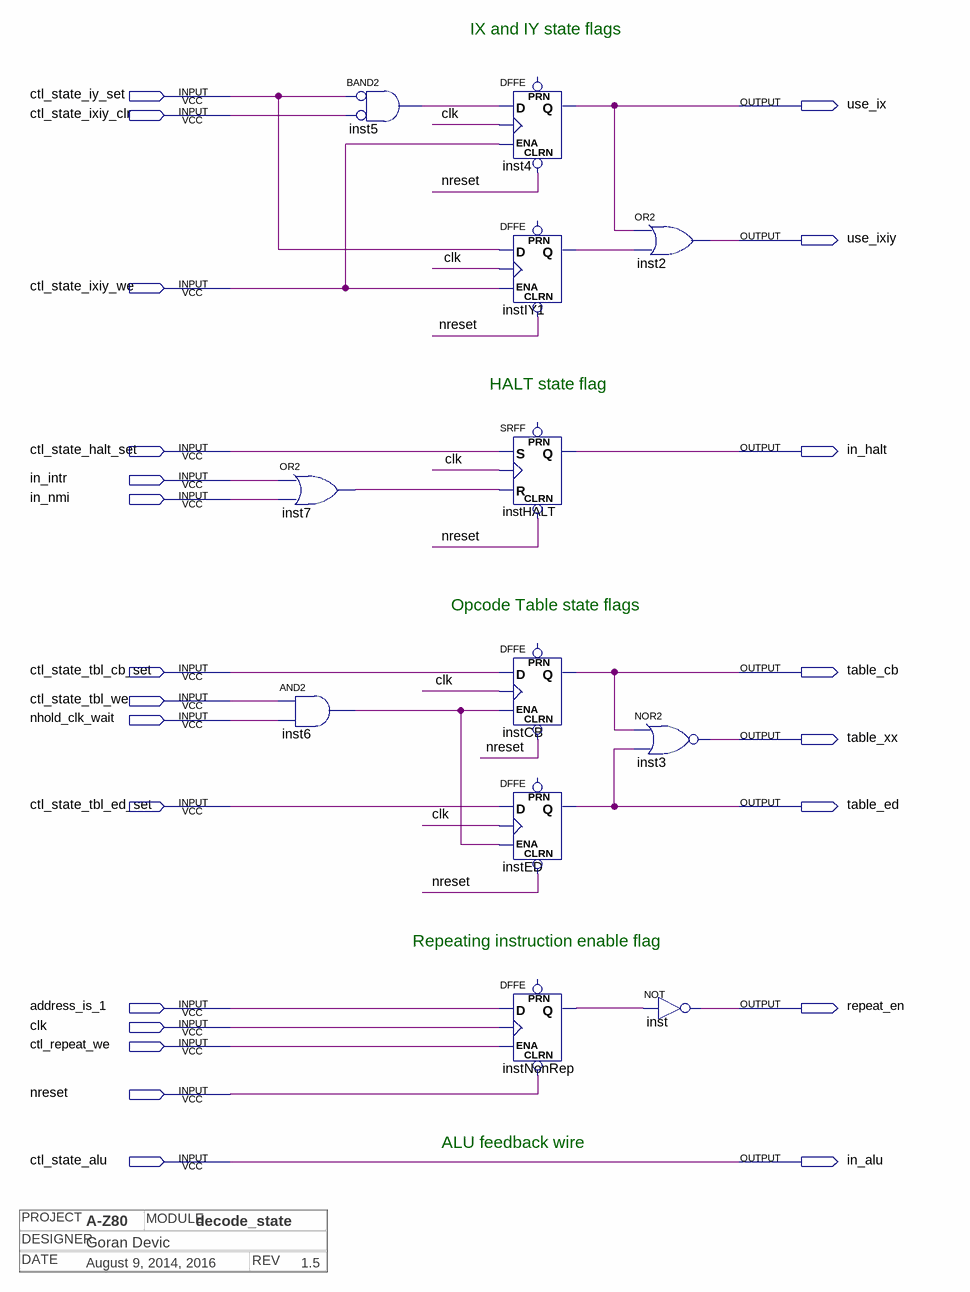
[diagram p0: schematic sheet]
// Quartus schematic decode_state.bdf as structural Verilog: 12 symbols, 23 pins
// Title block: PROJECT: A-Z80; MODULE: decode_state; DESIGNER: Goran Devic; DATE: August 9, 2014, 2016; REV: 1.5
module decode_state (
  input  ctl_state_iy_set,
  input  ctl_state_ixiy_clr,
  input  ctl_state_ixiy_we,
  input  ctl_state_halt_set,
  input  in_intr,
  input  in_nmi,
  input  ctl_state_tbl_cb_set,
  input  ctl_state_tbl_we,
  input  nhold_clk_wait,
  input  ctl_state_tbl_ed_set,
  input  address_is_1,
  input  clk,
  input  ctl_repeat_we,
  input  nreset,
  input  ctl_state_alu,
  output use_ix,
  output use_ixiy,
  output in_halt,
  output table_cb,
  output table_xx,
  output table_ed,
  output repeat_en,
  output in_alu
);

  wire inst5_out, inst6_out, inst7_out, instIY1_q, instNonRep_q;

  and inst5 (inst5_out, ~ctl_state_iy_set, ~ctl_state_ixiy_clr);  // BAND2
  or inst7 (inst7_out, in_intr, in_nmi);
  and inst6 (inst6_out, ctl_state_tbl_we, nhold_clk_wait);
  DFFE inst4 (.CLRN(nreset), .D(inst5_out), .CLK(clk), .ENA(ctl_state_ixiy_we), .Q(use_ix));  // open: PRN
  DFFE instIY1 (.CLRN(nreset), .D(ctl_state_iy_set), .CLK(clk), .ENA(ctl_state_ixiy_we), .Q(instIY1_q));  // open: PRN
  SRFF instHALT (.CLRN(nreset), .S(ctl_state_halt_set), .R(inst7_out), .CLK(clk), .Q(in_halt));  // open: PRN
  DFFE instCB (.CLRN(nreset), .D(ctl_state_tbl_cb_set), .CLK(clk), .ENA(inst6_out), .Q(table_cb));  // open: PRN
  DFFE instED (.CLRN(nreset), .D(ctl_state_tbl_ed_set), .CLK(clk), .ENA(inst6_out), .Q(table_ed));  // open: PRN
  DFFE instNonRep (.CLRN(nreset), .D(address_is_1), .CLK(clk), .ENA(ctl_repeat_we), .Q(instNonRep_q));  // open: PRN
  or inst2 (use_ixiy, use_ix, instIY1_q);
  nor inst3 (table_xx, table_cb, table_ed);
  not inst (repeat_en, instNonRep_q);

  assign in_alu = ctl_state_alu;

  // Notes on the sheet:
  //   IX and IY state flags
  //   HALT state flag
  //   Opcode Table state flags
  //   Repeating instruction enable flag
  //   ALU feedback wire
endmodule
